# Altium schematic sheet Receiver.SchDoc
size A4; SheetNumber: 2; SheetTotal: 7
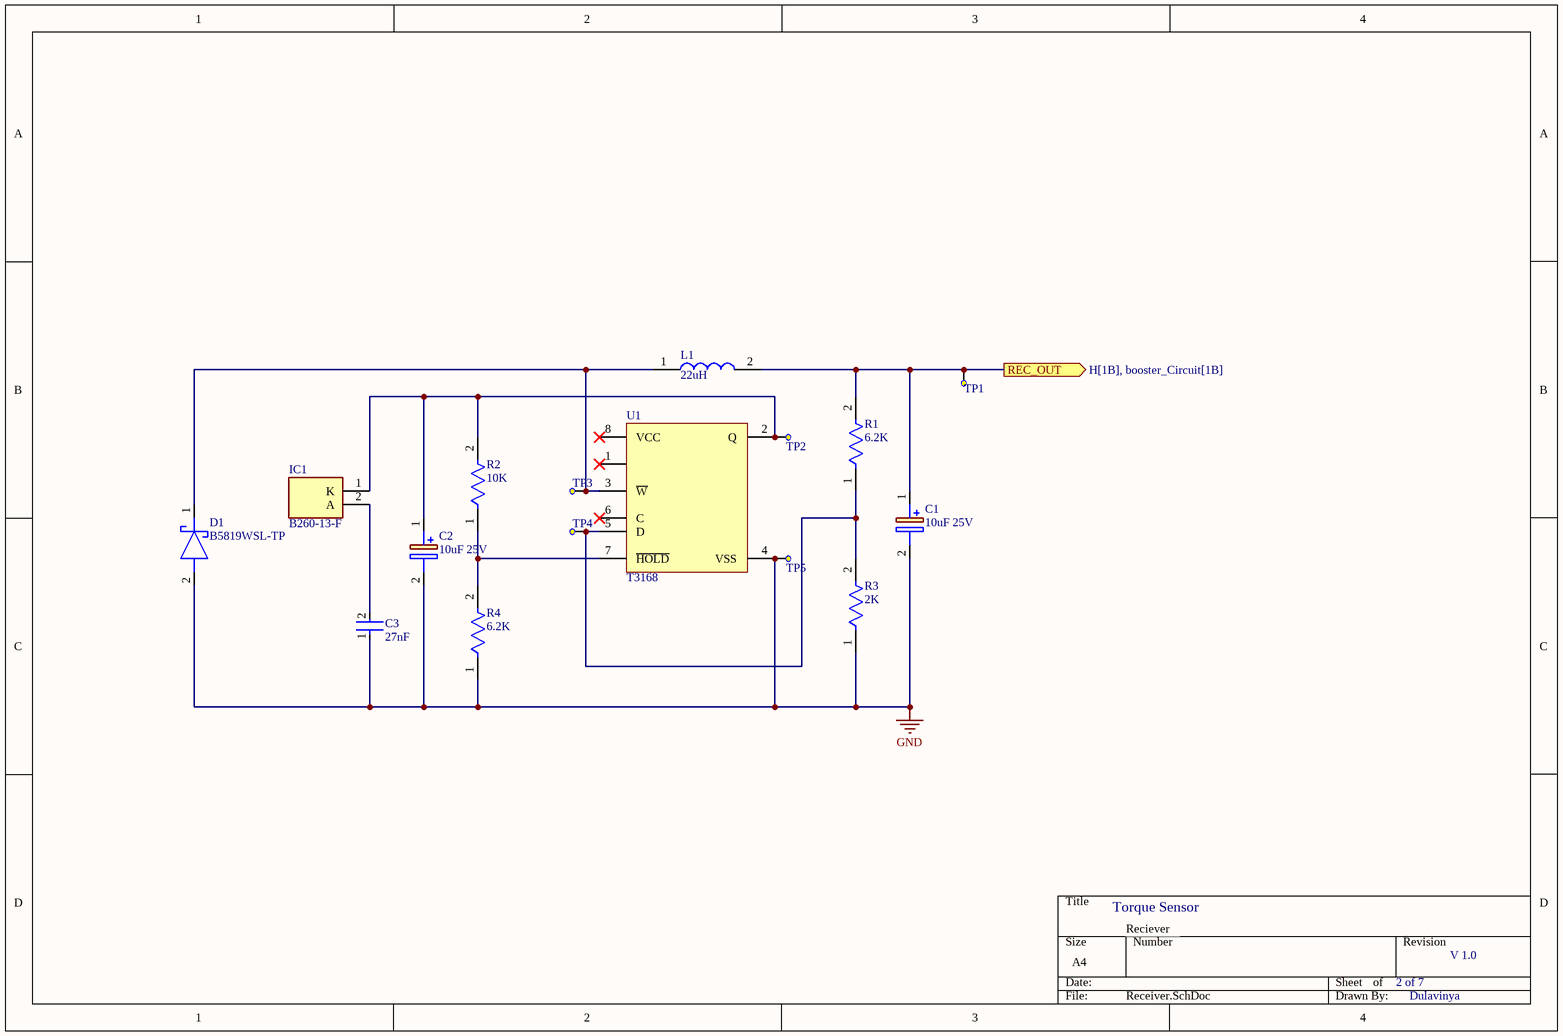
[diagram p0: Receiver.SchDoc]

## Parts
C1  10uF 25V  [CAPAE660X565N]
C2  10uF 25V  [CAPAE660X565N]
C3  27nF  [FP-CL05A106MP5NUNC-MFG]
D1  B5819WSL-TP  [SODFL2512X90N]
IC1  B260-13-F  [DIOM5336X250N]
L1  22uH  [INDPM6868X420N]
R1  6.2K  [FP-ERJ2R-MFG]
R2  10K  [FP-ERJ2R-MFG]
R3  2K  [FP-ERJ2R-MFG]
R4  6.2K  [FP-ERJ2R-MFG]
TP1  Test point  [Test_point]  (value not drawn)
TP2  Test point  [Test_point]  (value not drawn)
TP3  Test point  [Test_point]  (value not drawn)
TP4  Test point  [Test_point]  (value not drawn)
TP5  Test point  [Test_point]  (value not drawn)
U1  T3168  [SOP127P600X173-8_PRSP0008DF-B_N]

## Ports
REC_OUT (out, see H[1B], booster_Circuit[1B])

## Nets
GND: C1.2(-) C2.2(-) C3.1 D1.2(A) R3.1 R4.1 TP5.TP?(Test_point) U1.4(VSS)
REC_OUT: C1.1(+) L1.2 R1.2 TP1.TP?(Test_point) ; port REC_OUT
NetC2_1: C2.1(+) IC1.1(K) R2.2 TP2.TP?(Test_point) U1.2(Q)
NetC3_2: C3.2 IC1.2(A)
NetD1_1: D1.1(K) L1.1 TP3.TP?(Test_point) U1.3(~{W})
NetR1_1: R1.1 R3.2 TP4.TP?(Test_point) U1.5(D)
NetR2_1: R2.1 R4.2 U1.7(~{HOLD})

Not connected (* = marked no-connect by the designer): U1 1(~{S})* 6(C)* 8(VCC)*

## Notes on the sheet
- Torque Sensor
- Reciever
- 2 of 7
- V 1.0
- Dulavinya

## Library data of the parts
C1 C2 = EDK106M025A9BAA: Capacitor Polarised; Manufacturer_Name: KEMET; Datasheet Link: https://content.kemet.com/datasheets/KEM_A4001_EDK.pdf; Height: 5.65mm; Manufacturer_Part_Number: EDK106M025A9BAA; Mouser Part Number: 80-EDK106M025A9BAA; Mouser Price/Stock: https://www.mouser.co.uk/ProductDetail/KEMET/EDK106M025A9BAA?qs=Z46kSA%2FmtFjJXqafPHKnBQ%3D%3D; Arrow Part Number: EDK106M025A9BAA; Arrow Price/Stock: https://www.arrow.com/en/products/edk106m025a9baa/kemet-corporation?region=nac
C3 = CMP-13271-000002-1: CAP CER 10UF 10V X5R 0402; Manufacturer Part Number: CL05A106MP5NUNC; Manufacturer: Samsung; Temperature Coefficient: 15%; Tolerance: 20%; Material: Ceramic; Octopart: https://octopart.com/cl05a106mp5nunc-samsung-22457395; Voltage Rating: 10V; RoHS: TRUE; Value: 10uF; Height: 0.7mm; Digikey Description: CAP CER 10UF 10V X5R 0402; Automotive: No; Package: CL05A106MP5NUNC; Device Class L1: Passive Components; Capacitance: 10uF; Temperature Range High: +85°C; ComponentLink2Description: Datasheet; Device Class L2: Capacitors; Temperature Characteristic: X5R; Temperature: -55°C to +85°C; ComponentLink2URL: http://www.samsungsem.com/kr/support/product-search/mlcc/__icsFiles/afieldfile/2019/05/10/19-CL05A106MP5NUNC.pdf; Device Class L3: Ceramic Capacitors; Category: Cap; Temperature Range Low: -55°C; Ipc Land Pattern Name: CAPC10050X50; Lead Free: Yes
D1 = B5819WSL-TP: Schottky Diode; Manufacturer_Name: MCC; Datasheet Link: https://www.mccsemi.com/pdf/Products/B5819WSL(SOD-323FL).pdf; Height: 0.9mm; Manufacturer_Part_Number: B5819WSL-TP; Mouser Part Number: 833-B5819WSL-TP; Mouser Price/Stock: https://www.mouser.co.uk/ProductDetail/Micro-Commercial-Components-MCC/B5819WSL-TP?qs=P1JMDcb91o4r0%252BAOOuFpvQ%3D%3D; Arrow Part Number: B5819WSL-TP; Arrow Price/Stock: https://www.arrow.com/en/products/b5819wsl-tp/micro-commercial-components?utm_currency=USD&region=nac
IC1 = B260-13-F: Integrated Circuit; Manufacturer_Name: Diodes Incorporated; Datasheet Link: https://datasheet.datasheetarchive.com/originals/distributors/Datasheets-9/DSA-164385.pdf; Height: 2.5mm; Manufacturer_Part_Number: B260-13-F; Mouser Part Number: 621-B260-F; Mouser Price/Stock: https://www.mouser.co.uk/ProductDetail/Diodes-Incorporated/B260-13-F?qs=eVtA5waOtifTWH0TOzQQ1A%3D%3D; Arrow Part Number: B260-13-F; Arrow Price/Stock: https://www.arrow.com/en/products/b260-13-f/diodes-incorporated?region=nac
L1 = SRR6838A-220M: Inductor; Manufacturer_Name: Bourns; Datasheet Link: https://g.componentsearchengine.com/Datasheets/0/20314706.pdf; Height: 4.2mm; Manufacturer_Part_Number: SRR6838A-220M; Mouser Part Number: 652-SRR6838A-220M; Mouser Price/Stock: https://www.mouser.co.uk/ProductDetail/Bourns/SRR6838A-220M?qs=%252BHhoWzUJg4J5KkdY%2FweA6w%3D%3D
R1-R4 = CMP-2002-00694-4: RES SMD 15K OHM 1% 1/10W 0402; Manufacturer Part Number: ERJ-2RKF1502X; Manufacturer: Panasonic; Automotive Grade: Grade 0; Voltage Rating: 50V; Resistance: 15kΩ; Temperature Coefficient: 100ppm/°C; Power Rating: 0.1W; Value: 15kΩ; ComponentLink2URL: https://industrial.panasonic.com/cdbs/www-data/pdf/RDA0000/AOA0000C304.pdf; Automotive: Yes; Temperature: -55°C to +155°C; Height: 0.4mm; Digikey Description: RES SMD 15K OHM 1% 1/10W 0402; Category: Res; Device Class L2: Resistors; Device Class L1: Passive Components; Package: ERJ2R; Temperature Range Low: -55°C; Tolerance: 1%; Series: ERJ; Footprint Url: https://b2b-api.panasonic.eu/file_stream/pids/fileversion/1180; Mouser Description: Res Thick Film 1.0 x 0.5 mm 15K Ohm 1% 0.1W(1/10W) 100ppm/ C Molded SMD Punched Carrier T/R; Composition: Thick Film; Lead Free: Yes; Device Class L3: Chip SMD Resistors; Octopart: https://octopart.com/erj-2rkf1502x-panasonic-55404985; RoHS: TRUE; Temperature Range High: +155°C; ComponentLink2Description: Datasheet
TP1-TP5 = test_point: Value: Test point
U1 = CMP-00572-21273503-1: Serial Peripheral Interface 32k EEPROM (4-kword × 8-bit) 64k EEPROM (8-kword × 8-bit); Manufacturer Lifecycle Status: ACTIVE; Interface: SPI; Clock Rate: 3MHz; Frequency: 5MHz; Memory Size: 64kB; Min Input Voltage: 1.8V; Max Input Voltage: 5.5V; ComponentLink3Description: Manufacturer's Package Drawing; Length: 5mm; ComponentLink1Description: Manufacturer's Website; Mount: Surface Mount; Lead Free: Lead Free; ComponentLink3URL: https://www.renesas.com/en/document/psc/package-drawing-sop-8pin-prsp0008df-b; HelpURL: https://octopart.com/cad-content/api/get-model-datasheet/15189/21273503; Min Operating Temperature: -40°C; Lifecycle Status: Production; Number of Pins: 8; Case/Package: SOP; Packaging: Tape & Reel (TR); Height: 1.73mm; RoHS: Compliant; Width: 4mm; ComponentLink2URL: https://octopart.com/cad-content/api/get-model-datasheet/15189/21273503; ComponentLink2Description: Datasheet URL; China RoHS: Compliant; Memory Type: EEPROM; ComponentLink1URL: http://www.renesas.com; Min Supply Voltage: 1.8V; Max Supply Voltage: 5.5V; Max Operating Temperature: 85°C